# Altium schematic sheet Breakout_FPGA.SchDoc
size B; DocumentNumber: 6; SheetNumber: 6; SheetTotal: 8
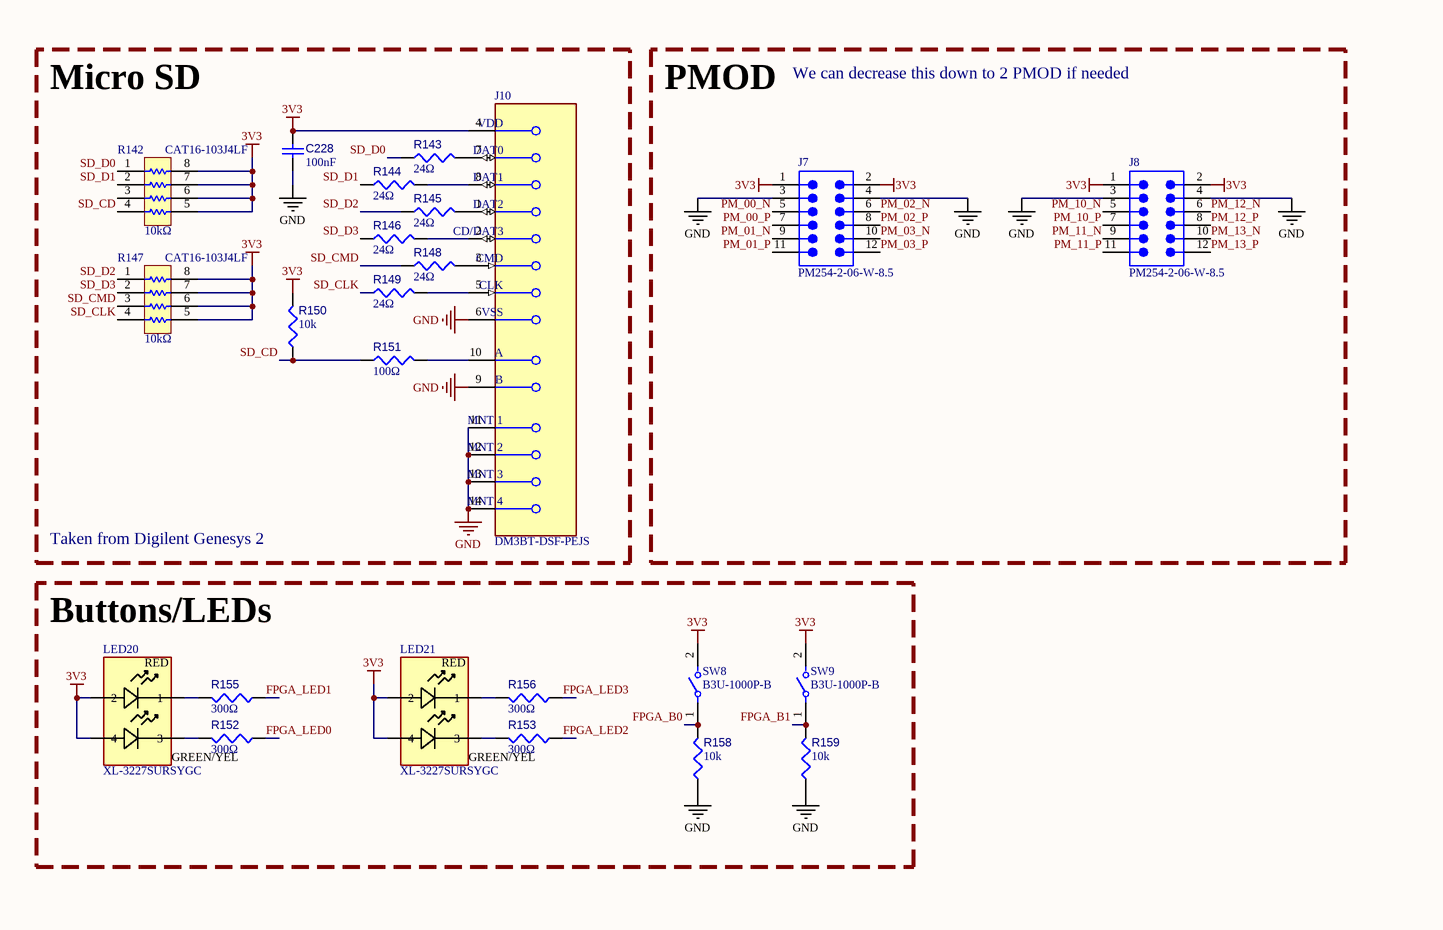
[diagram p0: Breakout_FPGA.SchDoc, left]
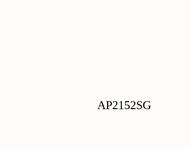
[diagram p1: Breakout_FPGA.SchDoc, right]

## Parts
C228  value 100nF  [CAP-0402-MFG]  (hidden comment: CL05B104KA54PNC)
J7  PM254-2-06-W-8.5  [2x6-RA-FEM-2.54mm-CONN]
J8  PM254-2-06-W-8.5  [2x6-RA-FEM-2.54mm-CONN]
J10  DM3BT-DSF-PEJS  [MICROSD-10(8+2)-MFG]
LED20  XL-3227SURSYGC  [LED-1210-4P-MFG]
LED21  XL-3227SURSYGC  [LED-1210-4P-MFG]
R142  CAT16-103J4LF  value 10kΩ  [RES-4x0603-MFG]
R143  value 24Ω  [RES-0402]  (hidden comment: AC0402FR-0724RL)
R144  value 24Ω  [RES-0402]  (hidden comment: AC0402FR-0724RL)
R145  value 24Ω  [RES-0402]  (hidden comment: AC0402FR-0724RL)
R146  value 24Ω  [RES-0402]  (hidden comment: AC0402FR-0724RL)
R147  CAT16-103J4LF  value 10kΩ  [RES-4x0603-MFG]
R148  value 24Ω  [RES-0402]  (hidden comment: AC0402FR-0724RL)
R149  value 24Ω  [RES-0402]  (hidden comment: AC0402FR-0724RL)
R150  value 10k  [RES-0402]  (hidden comment: AC0402FR-0710KL)
R151  value 100Ω  [RES-0402]  (hidden comment: AC0402FR-07100RL)
R152  value 300Ω  [RES-0402]  (hidden comment: AC0402FR-07300RL)
R153  value 300Ω  [RES-0402]  (hidden comment: AC0402FR-07300RL)
R155  value 300Ω  [RES-0402]  (hidden comment: AC0402FR-07300RL)
R156  value 300Ω  [RES-0402]  (hidden comment: AC0402FR-07300RL)
R158  value 10k  [RES-0402]  (hidden comment: AC0402FR-0710KL)
R159  value 10k  [RES-0402]  (hidden comment: AC0402FR-0710KL)
SW8  B3U-1000P-B  [FP-B3U-1000P-B-MFG]
SW9  B3U-1000P-B  [FP-B3U-1000P-B-MFG]

## Blocks framed on the sheet
Micro SD: C228 J10 R142-R151
PMOD: J7 J8
Buttons/LEDs: LED20 LED21 R152 R153 R155 R156 R158 R159 SW8 SW9

## Nets
3V3: C228.1 J7.1 J7.2 J8.1 J8.2 J10.4(VDD) LED20.2 LED20.4 LED21.2 LED21.4 R142.5 R142.6 R142.7 R142.8 R147.5 R147.6 R147.7 R147.8 R150.2 SW8.2 SW9.2
GND: C228.2 J7.3 J7.4 J8.3 J8.4 J10.6(VSS) J10.9(B) J10.11(MNT_1) J10.12(MNT_2) J10.13(MNT_3) J10.14(MNT_4) R158.1 R159.1
FPGA_B0: R158.2 SW8.1
FPGA_B1: R159.2 SW9.1
FPGA_LED0: R152.2
FPGA_LED1: R155.2
FPGA_LED2: R153.2
FPGA_LED3: R156.2
PM_00_N: J7.5
PM_00_P: J7.7
PM_01_N: J7.9
PM_01_P: J7.11
PM_02_N: J7.6
PM_02_P: J7.8
PM_03_N: J7.10
PM_03_P: J7.12
PM_10_N: J8.5
PM_10_P: J8.7
PM_11_N: J8.9
PM_11_P: J8.11
PM_12_N: J8.6
PM_12_P: J8.8
PM_13_N: J8.10
PM_13_P: J8.12
SD_CD: R142.4 R150.1 R151.1
SD_CLK: R147.4 R149.1
SD_CMD: R147.3 R148.1
SD_D0: R142.1 R143.1
SD_D1: R142.2 R144.1
SD_D2: R145.1 R147.1
SD_D3: R146.1 R147.2
NetJ10_1: J10.1(DAT2) R145.2
NetJ10_2: J10.2(CD/DAT3) R146.2
NetJ10_3: J10.3(CMD) R148.2
NetJ10_5: J10.5(CLK) R149.2
NetJ10_7: J10.7(DAT0) R143.2
NetJ10_8: J10.8(DAT1) R144.2
NetJ10_10: J10.10(A) R151.2
NetLED20_1: LED20.1 R155.1
NetLED20_3: LED20.3 R152.1
NetLED21_1: LED21.1 R156.1
NetLED21_3: LED21.3 R153.1

Not connected (* = marked no-connect by the designer): R142 3

## Notes on the sheet
- We can decrease this down to 2 PMOD if needed
- Taken from Digilent Genesys 2
- AP2152SG
- (in symbol CMP-132-000003-3) RED; GREEN/YEL

## Library data of the parts
C228 = CMP-104-000104-6: 0402-100n-10%-25V-X7R-AECQ200; Manufacturer Name: Samsung; Capacitor Type: Ceramic; Voltage Rating: 25V; Tolerance: 10%; Temp Code: X7R; Min Operating Temperature: -55°C; Component Type: Standard; Max Operating Temperature: 125°C; Case/Package: 0402; Info: 0402-100n-10%-25V-X7R-AECQ200; Pins: 2; Pin Count: 2; Mounting Technology: Surface Mount; Manufacturer Part Number: CL05B104KA54PNC; Design Item ID: CMP-001-00131-1; Source: Components - 11.02.26 - 17.26.SchLib; JLC PN: C346180
J7 J8 = CMP-055-000216-1: Pin Header, Board-to-Board, 2.54 mm, 2 Rows, 12 Contacts, Through Hole, TSW Series; Manufacturer Name: HCTL; Pitch: 2.54mm; Gender: Female; Max Current Rating: 7.6A; Connector Type: Male Pin; Number of Positions: 12; Mounting Technology: Through Hole; Max Operating Temperature: 105°C; JLC PN: C2897426; Termination: Solder; Number of Rows: 2; Min Operating Temperature: -40°C; Manufacturer Part Number: PM254-2-06-W-8.5
J10 = CMP-055-000213-2: Memory Card Connector, MicroSD, Push-Push, 8 Contacts, Copper Alloy, Gold Plated Contacts, DM3; Manufacturer Name: Hirose; Connector Type: Connector, Socket; Gender: Female; Max Current Rating: 500mA; Contact Pitch: 1.1mm; Min Operating Temperature: -25°C; Contact Plating: Gold; Max Operating Temperature: 85°C; Mounting Technology: Surface Mount; JLC PN: C597972; Pins: 8; Manufacturer Part Number: DM3BT-DSF-PEJS
LED20 LED21 = CMP-132-000003-3: LED indicator light dual color red yellow green 1210 front facing; Manufacturer Name: XINLIGHT; Manufacturer Part Number: XL-3227SURSYGC; JLC PN: C965843
R142 R147 = CMP-014-000100-1: Res Thick Film Array 10K Ohm 5% 0.25W(1/4W) ±200ppm/C ISOL 8-Pin 1206(4 X 0603) Concave SMD T/R; Manufacturer Name: Bourns; Number of Resistors: 4; Voltage Rating (DC): 50V; Power Dissipation: 250mW; Mounting Technology: Surface Mount; Tolerance: 5%; Manufacturer Part Number: CAT16-103J4LF; Min Operating Temperature: -55°C; JLC PN: C840650; Case/Package: 0603x4; Max Operating Temperature: 125°C; Pins: 8
R143-R146 R148 R149 = CMP-014-000123-4: 0402-24-1%-1/16W-AEC-Q200; Manufacturer Name: YAGEO; Tolerance: 1%; Voltage Rating: 50V; Power: 63mW; Case/Package: 0402; Mounting Technology: Surface Mount; Manufacturer Part Number: AC0402FR-0724RL; Design Item ID: CMP-009-00210-1; Pins: 2; Min Operating Temperature: -55°C; Info: 0402-24-1%-1/16W-AEC-Q200; Source: Components - 11.02.26 - 17.27.SchLib; Max Operating Temperature: 155°C; JLC PN: C226373
R150 R158 R159 = CMP-014-000077-5: 0402-10k-1%-1/16W-AEC-Q200; Manufacturer Name: YAGEO; Tolerance: 1%; Voltage Rating: 50V; Power: 63mW; Pins: 2; Source: Components - 11.02.26 - 17.27.SchLib; Manufacturer Part Number: AC0402FR-0710KL; Info: 0402-10k-1%-1/16W-AEC-Q200; Min Operating Temperature: -55°C; Pin Count: 2; Case/Package: 0402; Design Item ID: CMP-009-00191-3; Max Operating Temperature: 155°C; Component Type: Standard; Mounting Technology: Surface Mount; JLC PN: C144807
R151 = CMP-014-000108-4: 0402-100-1%-1/16W-AEC-Q200; Manufacturer Name: YAGEO; Voltage Rating: 50V; Power: 63mW; Tolerance: 1%; Case/Package: 0402; Manufacturer Part Number: AC0402FR-07100RL; Mounting Technology: Surface Mount; Pin Count: 2; Component Type: Standard; Max Operating Temperature: 155°C; Pins: 2; Design Item ID: CMP-009-00202-1; Min Operating Temperature: -55°C; Source: Components - 11.02.26 - 17.27.SchLib; Info: 0402-100-1%-1/16W-AEC-Q200; JLC PN: C144808
R152 R153 R155 R156 = CMP-014-000122-4: 0402-300-1%-1/16W-AEC-Q200; Manufacturer Name: YAGEO; Voltage Rating: 50V; Power: 63mW; Tolerance: 1%; Case/Package: 0402; Info: 0402-300-1%-1/16W-AEC-Q200; Pins: 2; Source: Components - 11.02.26 - 17.27.SchLib; Manufacturer Part Number: AC0402FR-07300RL; Max Operating Temperature: 155°C; Mounting Technology: Surface Mount; Design Item ID: CMP-009-00210-1; Min Operating Temperature: -55°C; JLC PN: C144768
SW8 SW9 = CMP-015-000062-1: Switch Tactile N.O. SPST Round Button Gull Wing 0.05A 12VDC 1.5N SMD Embossed T/R; Manufacturer Name: Omron; Contact Resistance: 100mΩ; Switch Function: Off-Mom; Max Current Rating: 50mA; Voltage Rating (DC): 12V; Manufacturer Part Number: B3U-1000P-B; Switch Type: SPST; Max Operating Temperature: 70°C; Mounting Technology: Surface Mount; JLC PN: C231329; Min Operating Temperature: -25°C